# EAGLE schematic Smart Lysimeter (EAGLE 9.2.1)
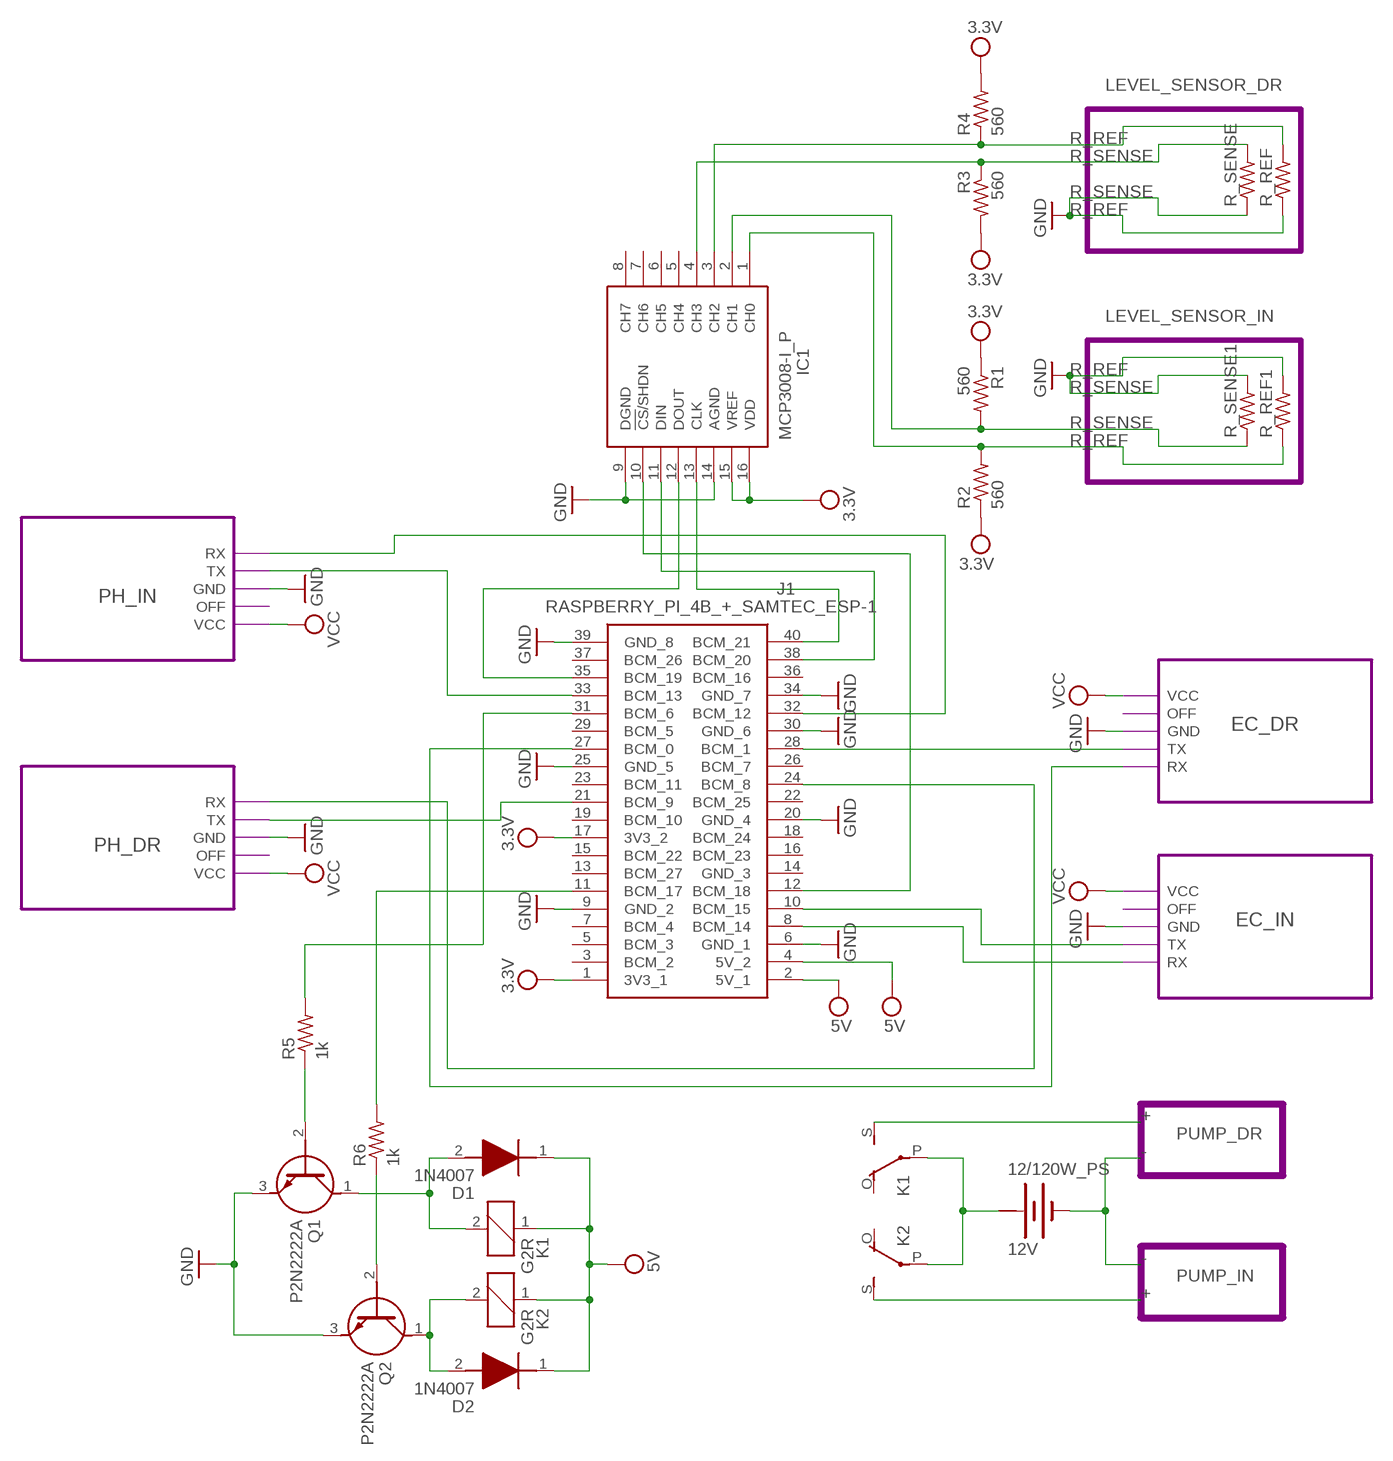
[diagram p0: schematic, sheet 1]

## Parts
12/120W_PS  12V  BATTERY  [BATTERY]
D1  1N4007  [DIOAD1206W86L406D200]
D2  1N4007  [DIOAD1206W86L406D200]
IC1  MCP3008-I_P  [DIP781W56P254L1918H533Q16N]
J1  RASPBERRY_PI_4B_+_SAMTEC_ESP-1  [RASPBERRYPI4B4GB]
K1  G2R  [G2R]
K2  G2R  [G2R]
Q1  P2N2222A  [P2N2222A]
Q2  P2N2222A  [P2N2222A]
R1  560  R-US_0207/12  [0207/12]
R2  560  R-US_0207/12  [0207/12]
R3  560  R-US_0207/12  [0207/12]
R4  560  R-US_0207/12  [0207/12]
R5  1k  R-US_0207/12  [0207/12]
R6  1k  R-US_0207/12  [0207/12]
R_REF  R-US_0207/12  [0207/12]
R_REF1  R-US_0207/12  [0207/12]
R_SENSE  R-US_0207/12  [0207/12]
R_SENSE1  R-US_0207/12  [0207/12]

## Module instances
EC_DR = LEVEL_SENSOR_IN
EC_IN1 = LEVEL_SENSOR_IN
PH_IN = LEVEL_SENSOR_IN
PH_DR = LEVEL_SENSOR_IN

## Nets
+: K1.S(2:S) K2.S(2:S)
-: 12/120W_PS.-
GND: IC1.9(DGND) IC1.14(AGND) J1.6(GND_1) J1.9(GND_2) J1.20(GND_4) J1.25(GND_5) J1.30(GND_6) J1.34(GND_7) J1.39(GND_8) Q1.3(E) Q2.3(E) R_REF1.2 R_SENSE1.2 ; port EC_DR.GND EC_IN1.GND PH_IN.GND PH_DR.GND
GND1: IC1.1(CH0) IC1.2(CH1) R1.2 R2.2 R_REF1.1 R_SENSE1.1
N$1: IC1.13(CLK) J1.40(BCM_21)
N$2: IC1.12(DOUT) J1.35(BCM_19)
N$3: IC1.11(DIN) J1.38(BCM_20)
N$4: IC1.10(!CS!/SHDN) J1.12(BCM_18)
N$6: 12/120W_PS.+ K1.P(2:P) K2.P(2:P)
N$7: J1.8(BCM_14) ; port EC_IN1.RX
N$8: J1.10(BCM_15) ; port EC_IN1.TX
N$9: J1.28(BCM_1) ; port EC_DR.TX
N$10: J1.27(BCM_0) ; port EC_DR.RX
N$11: J1.21(BCM_9) ; port PH_DR.TX
N$12: J1.24(BCM_8) ; port PH_DR.RX
N$13: J1.33(BCM_13) ; port PH_IN.TX
N$14: J1.32(BCM_12) ; port PH_IN.RX
N$15: Q2.2(B) R6.1
N$16: D1.2(A) K1.2 Q1.1(C)
N$17: D2.2(A) K2.2 Q2.1(C)
N$18: Q1.2(B) R5.1
N$19: J1.11(BCM_17) R6.2
N$20: J1.31(BCM_6) R5.2
R_REF: IC1.3(CH2) R4.1 R_REF.1 R_REF.2 R_SENSE.1 ; supply symbol labelled GND
R_SENSE: IC1.4(CH3) R3.1 R_SENSE.2
VCC: D1.1(K) D2.1(K) IC1.15(VREF) IC1.16(VDD) J1.1(3V3_1) J1.2(5V_1) J1.4(5V_2) J1.17(3V3_2) K1.1 K2.1 R1.1 R2.1 R3.2 R4.2 ; port EC_DR.VCC EC_IN1.VCC PH_IN.VCC PH_DR.VCC ; supply symbol labelled 3.3V, 5V
Unconnected: IC1.5(CH4) IC1.6(CH5) IC1.7(CH6) IC1.8(CH7) J1.3(BCM_2) J1.5(BCM_3) J1.7(BCM_4) J1.13(BCM_27) J1.15(BCM_22) J1.16(BCM_23) J1.18(BCM_24) J1.19(BCM_10) J1.22(BCM_25) J1.23(BCM_11) J1.26(BCM_7) J1.29(BCM_5) J1.36(BCM_16) J1.37(BCM_26) K1.O(2:O) K2.O(2:O)

## Notes on the sheet
- LEVEL_SENSOR_DR
- R_SENSE
- LEVEL_SENSOR_IN
- R_REF
- R_SENSE
- R_SENSE
- R_REF
- PUMP_DR
- PUMP_IN

## Power pins joined to a net without a drawn wire
+: 12/120W_PS.+@1(+)
GND_3: J1.14(GND_3)

## Library data of the parts
12/120W_PS = special:BATTERY: BATTERY
D1 D2 = 1N4007:1N4007: RECTIFIER, SINGLE, 1A, 1KV, DO-204AL Source: Datasheet <https://componentsearchengine.com/Datasheets/2/1N4007.pdf>; DESCRIPTION: RECTIFIER, SINGLE, 1A, 1KV, DO-204AL; HEIGHT: mm; MANUFACTURER_NAME: Taiwan Semiconductor; MANUFACTURER_PART_NUMBER: 1N4007; MOUSER_PART_NUMBER: 821-1N4007; MOUSER_PRICE-STOCK: https://www.mouser.co.uk/ProductDetail/Taiwan-Semiconductor/1N4007?qs=Wj6Zx%252B%252BkMrEpx8OqVQHXKw%3D%3D
IC1 = MCP3008-I_P:MCP3008-I_P: 2.7V 4-Channel/8-Channel 10-Bit A/D Converterswith SPI Serial Interface Source: Datasheet <https://datasheet.datasheetarchive.com/originals/distributors/Datasheets-DGA17/1031059.pdf>; ARROW_PART_NUMBER: MCP3008-I/P; ARROW_PRICE-STOCK: https://www.arrow.com/en/products/mcp3008-ip/microchip-technology?region=nac; DESCRIPTION: 2.7V 4-Channel/8-Channel 10-Bit A/D Converterswith SPI Serial Interface; HEIGHT: 5.334mm; MANUFACTURER_NAME: Microchip; MANUFACTURER_PART_NUMBER: MCP3008-I/P; MOUSER_PART_NUMBER: 579-MCP3008-I/P; MOUSER_PRICE-STOCK: https://www.mouser.co.uk/ProductDetail/Microchip-Technology/MCP3008-I-P?qs=AF%252BffTaPb30XZ0OdV6HdVg%3D%3D
J1 = RASPBERRY_PI_4B_+_Samtec_ESP-1:RASPBERRY_PI_4B_+_SAMTEC_ESP-1: RASPBERRY PI 4 MODEL B with Samtec ESP-120-33-G-D connector drawn from underneath for use as a plug in module. Source: Datasheet <https://www.raspberrypi.org/documentation/hardware/raspberrypi/mechanical/rpi_MECH_4b_4p0.pdf>; DESCRIPTION: RASPBERRY PI 4 MODEL B with Samtec ESP-120-33-G-D connector drawn from underneath for use as a plug in module.; HEIGHT: 24.3mm; MANUFACTURER_NAME: RASPBERRY-PI; MANUFACTURER_PART_NUMBER: RASPBERRY PI 4B + Samtec ESP-120-33-G-D
K1 K2 = relay:G2R: RELAY 1 x switch, Omron; OC_FARNELL: 1569185; OC_NEWARK: unknown
Q1 Q2 = P2N2222A:P2N2222A: TRANS NPN 40V 0.6A TO92 Source: Datasheet <https://cdn.sparkfun.com/datasheets/Components/General/P2N2222A-D.PDF>; DESCRIPTION: TRANS NPN 40V 0.6A TO92; HEIGHT: 7.87mm; MANUFACTURER_NAME: onsemi; MANUFACTURER_PART_NUMBER: P2N2222A; MOUSER_PART_NUMBER: 863-P2N2222A; MOUSER_PRICE-STOCK: https://www.mouser.co.uk/ProductDetail/onsemi/P2N2222A?qs=ZXBb0xZ9WeDg4uu%2Fxf3Z%252Bw%3D%3D
R1-R6 R_REF R_REF1 R_SENSE R_SENSE1 = resistor:R-US_: RESISTOR, American symbol

## Module LEVEL_SENSOR_IN
Ports: VCC(io) OFF(io) TX(io) RX(io) GND(io)

### Library data of the parts